# EAGLE schematic ControlInputs (EAGLE 7.5.0)
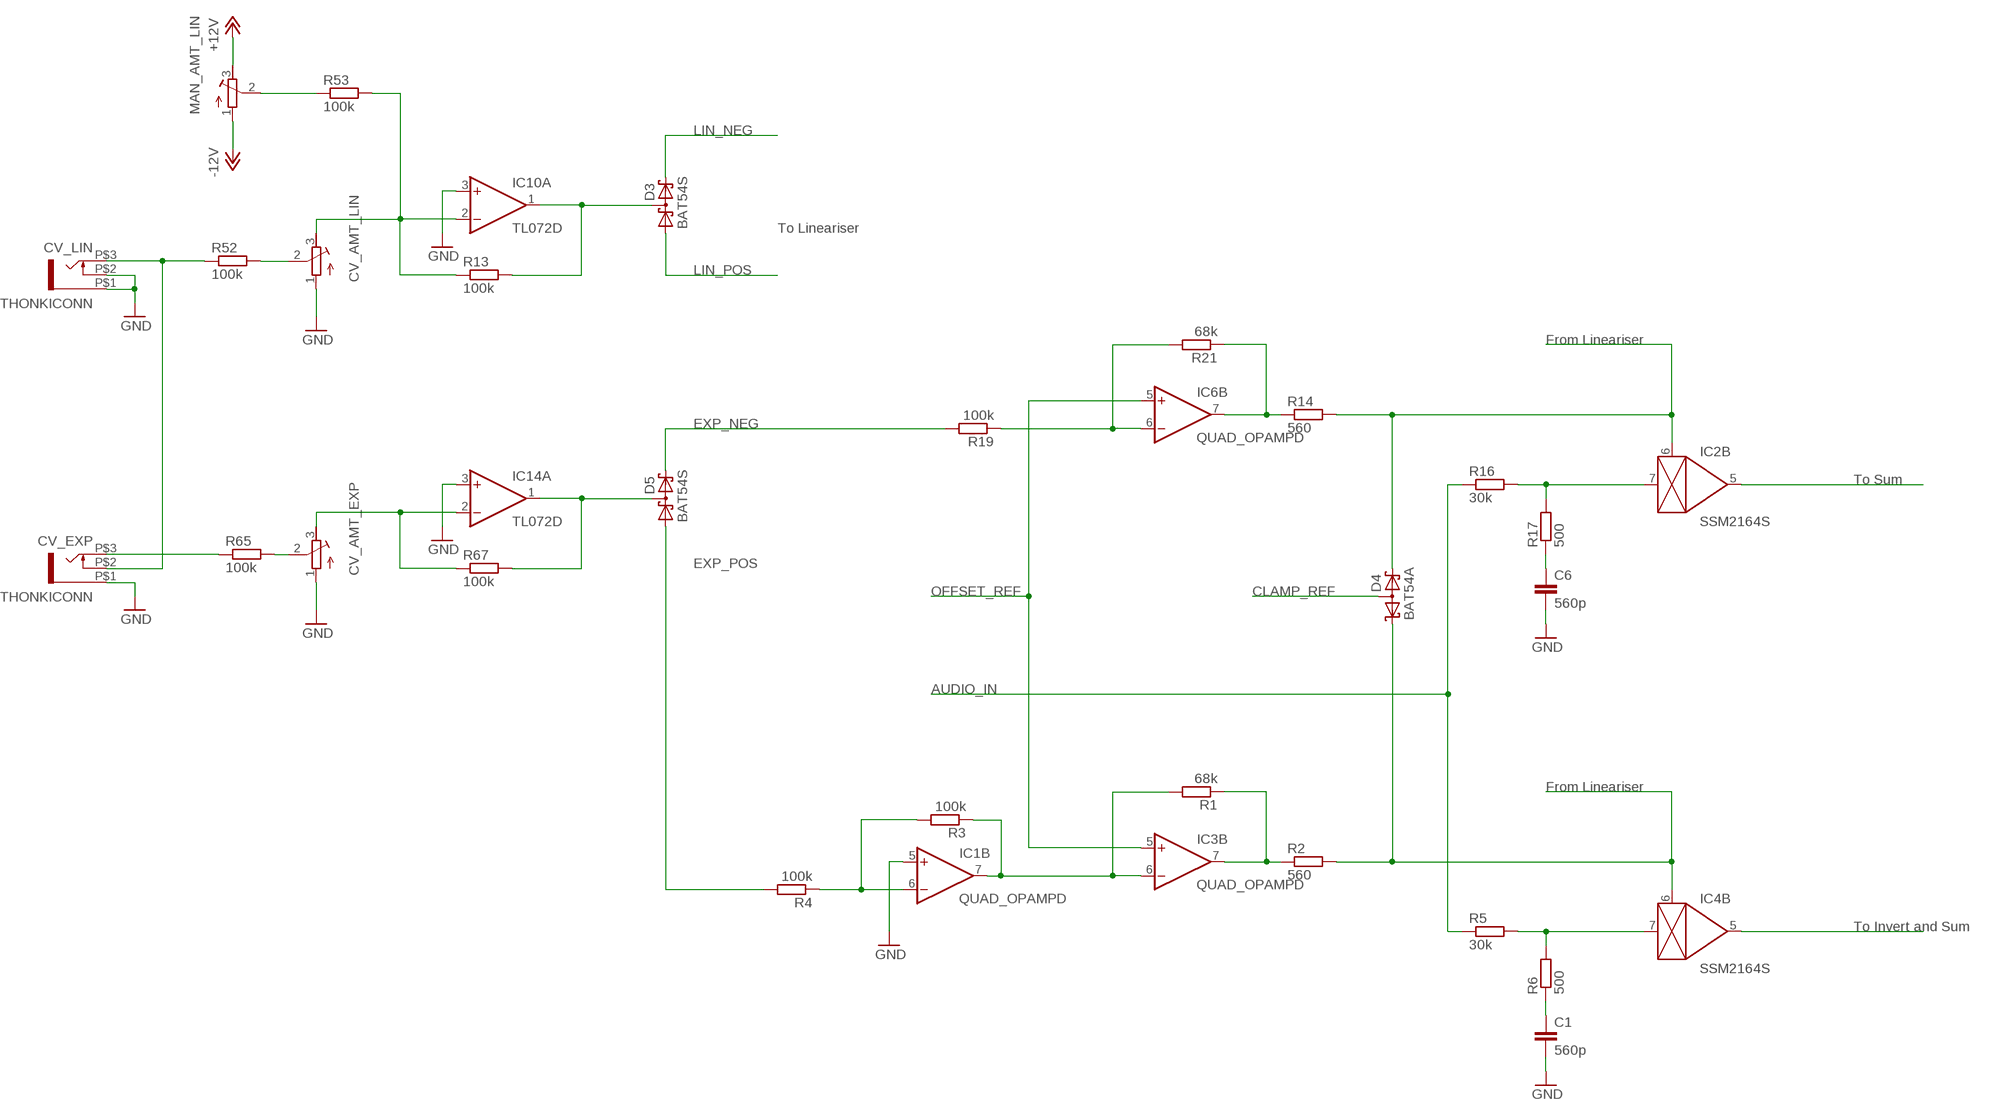
[diagram p0: schematic, sheet 1]

## Parts
C1  560p  C-EUC0603K  [C0603K]
C6  560p  C-EUC0603K  [C0603K]
CV_AMT_EXP  R-TRIMM64X  [RTRIM64X]
CV_AMT_LIN  R-TRIMM64X  [RTRIM64X]
CV_EXP  THONKICONN  [THONKICONN]
CV_LIN  THONKICONN  [THONKICONN]
D3  BAT54S  [SOT23]
D4  BAT54A  [SOT23]
D5  BAT54S  [SOT23]
IC1  QUAD_OPAMPD  [SO14]
IC2  SSM2164S  [SOIC16N]
IC3  QUAD_OPAMPD  [SO14]
IC4  SSM2164S  [SOIC16N]
IC6  QUAD_OPAMPD  [SO14]
IC10  TL072D  [SO08]
IC14  TL072D  [SO08]
MAN_AMT_LIN  R-TRIMM64X  [RTRIM64X]
R1  68k  R-EU_0603  [0603]
R2  560  R-EU_0603  [0603]
R3  100k  R-EU_0603  [0603]
R4  100k  R-EU_0603  [0603]
R5  30k  R-EU_0603  [0603]
R6  500  R-EU_0603  [0603]
R13  100k  R-EU_0603  [0603]
R14  560  R-EU_0603  [0603]
R16  30k  R-EU_0603  [0603]
R17  500  R-EU_0603  [0603]
R19  100k  R-EU_0603  [0603]
R21  68k  R-EU_0603  [0603]
R52  100k  R-EU_0603  [0603]
R53  100k  R-EU_0603  [0603]
R65  100k  R-EU_0603  [0603]
R67  100k  R-EU_0603  [0603]

## Nets
+12V: MAN_AMT_LIN.3(E)
-12V: MAN_AMT_LIN.1(A)
AUDIO_IN: R5.1 R16.1
CLAMP_REF: D4.3(AA)
EXP_NEG: D5.2(C2) R19.2
EXP_POS: D5.1(A1) R4.2
GND: C1.2 C6.2 CV_AMT_EXP.1(A) CV_AMT_LIN.1(A) CV_EXP.P$1 CV_LIN.P$1 CV_LIN.P$2 IC1.5(B:+IN) IC10.3(A:+IN) IC14.3(A:+IN)
IC2_1: IC3.7(B:OUT) R1.1 R2.1
IC2_2: IC1.7(B:OUT) IC3.6(B:-IN) R1.2 R3.1
IC2_6: IC6.7(B:OUT) R14.1 R21.1
IC2_7: IC6.6(B:-IN) R19.1 R21.2
LIN_NEG: D3.2(C2)
LIN_POS: D3.1(A1)
N$1: D4.1(K1) IC4.6(B:CTRL) R2.2
N$2: CV_AMT_LIN.3(E) IC10.2(A:-IN) R13.1 R53.2
N$3: D4.2(K2) IC2.6(B:CTRL) R14.2
N$5: IC1.6(B:-IN) R3.2 R4.1
N$6: C1.1 R6.1
N$7: CV_EXP.P$2 CV_LIN.P$3 R52.1
N$8: IC4.7(B:IN) R5.2 R6.2
N$11: C6.1 R17.1
N$12: IC2.7(B:IN) R16.2 R17.2
N$27: CV_AMT_LIN.2(S) R52.2
N$31: MAN_AMT_LIN.2(S) R53.1
N$58: CV_EXP.P$3 R65.1
N$59: D3.3(C1A2) IC10.1(A:OUT) R13.2
N$60: CV_AMT_EXP.2(S) R65.2
N$62: CV_AMT_EXP.3(E) IC14.2(A:-IN) R67.1
N$63: D5.3(C1A2) IC14.1(A:OUT) R67.2
OFFSET_REF: IC3.5(B:+IN) IC6.5(B:+IN)
OUT_B: IC2.5(B:OUT)
OUT_B1: IC4.5(B:OUT)
Unconnected: IC1.1(A:OUT) IC1.2(A:-IN) IC1.3(A:+IN) IC1.8(C:OUT) IC1.9(C:-IN) IC1.10(C:+IN) IC1.12(D:+IN) IC1.13(D:-IN) IC1.14(D:OUT) IC2.1(E:MODE) IC2.2(A:IN) IC2.3(A:CTRL) IC2.4(A:OUT) IC2.10(C:IN) IC2.11(C:CTRL) IC2.12(C:OUT) IC2.13(D:OUT) IC2.14(D:CTRL) IC2.15(D:IN) IC3.1(A:OUT) IC3.2(A:-IN) IC3.3(A:+IN) IC3.8(C:OUT) IC3.9(C:-IN) IC3.10(C:+IN) IC3.12(D:+IN) IC3.13(D:-IN) IC3.14(D:OUT) IC4.1(E:MODE) IC4.2(A:IN) IC4.3(A:CTRL) IC4.4(A:OUT) IC4.10(C:IN) IC4.11(C:CTRL) IC4.12(C:OUT) IC4.13(D:OUT) IC4.14(D:CTRL) IC4.15(D:IN) IC6.1(A:OUT) IC6.2(A:-IN) IC6.3(A:+IN) IC6.8(C:OUT) IC6.9(C:-IN) IC6.10(C:+IN) IC6.12(D:+IN) IC6.13(D:-IN) IC6.14(D:OUT) IC10.5(B:+IN) IC10.6(B:-IN) IC10.7(B:OUT) IC14.5(B:+IN) IC14.6(B:-IN) IC14.7(B:OUT)

## Notes on the sheet
- To Lineariser
- From Lineariser
- To Sum
- From Lineariser
- To Invert and Sum

## Power pins joined to a net without a drawn wire
GND: IC2.8(E:GND) IC4.8(E:GND)
V+: IC1.4(P:V+) IC2.16(E:V+) IC3.4(P:V+) IC4.16(E:V+) IC6.4(P:V+) IC10.8(P:V+) IC14.8(P:V+)
V-: IC1.11(P:V-) IC2.9(E:V-) IC3.11(P:V-) IC4.9(E:V-) IC6.11(P:V-) IC10.4(P:V-) IC14.4(P:V-)

## Library data of the parts
C1 C6 = resistor:C-EU: CAPACITOR, European symbol
CV_AMT_EXP CV_AMT_LIN MAN_AMT_LIN = resistor:R-TRIMM: Trimm resistor
CV_EXP CV_LIN = Rebel:THONKICONN
D3 D5 = diode:BAT54S: Schottky Diodes Pin connection corrected 2011-05-04 Source: Fairchild .. BAT54.pdf
D4 = diode:BAT54A: Schottky Diodes Source: Fairchild .. BAT54.pdf
IC1 IC3 IC6 = adafruit:QUAD_OPAMP: OP AMP Standard quad package
IC2 IC4 = ssm2164:SSM2164
IC10 IC14 = linear:TL072: OP AMP
R1-R6 R13 R14 R16 R17 R19 R21 R52 R53 R65 R67 = Rebel:R-EU_: RESISTOR, European symbol